# Altium project ECE8873_sample.PrjPcb
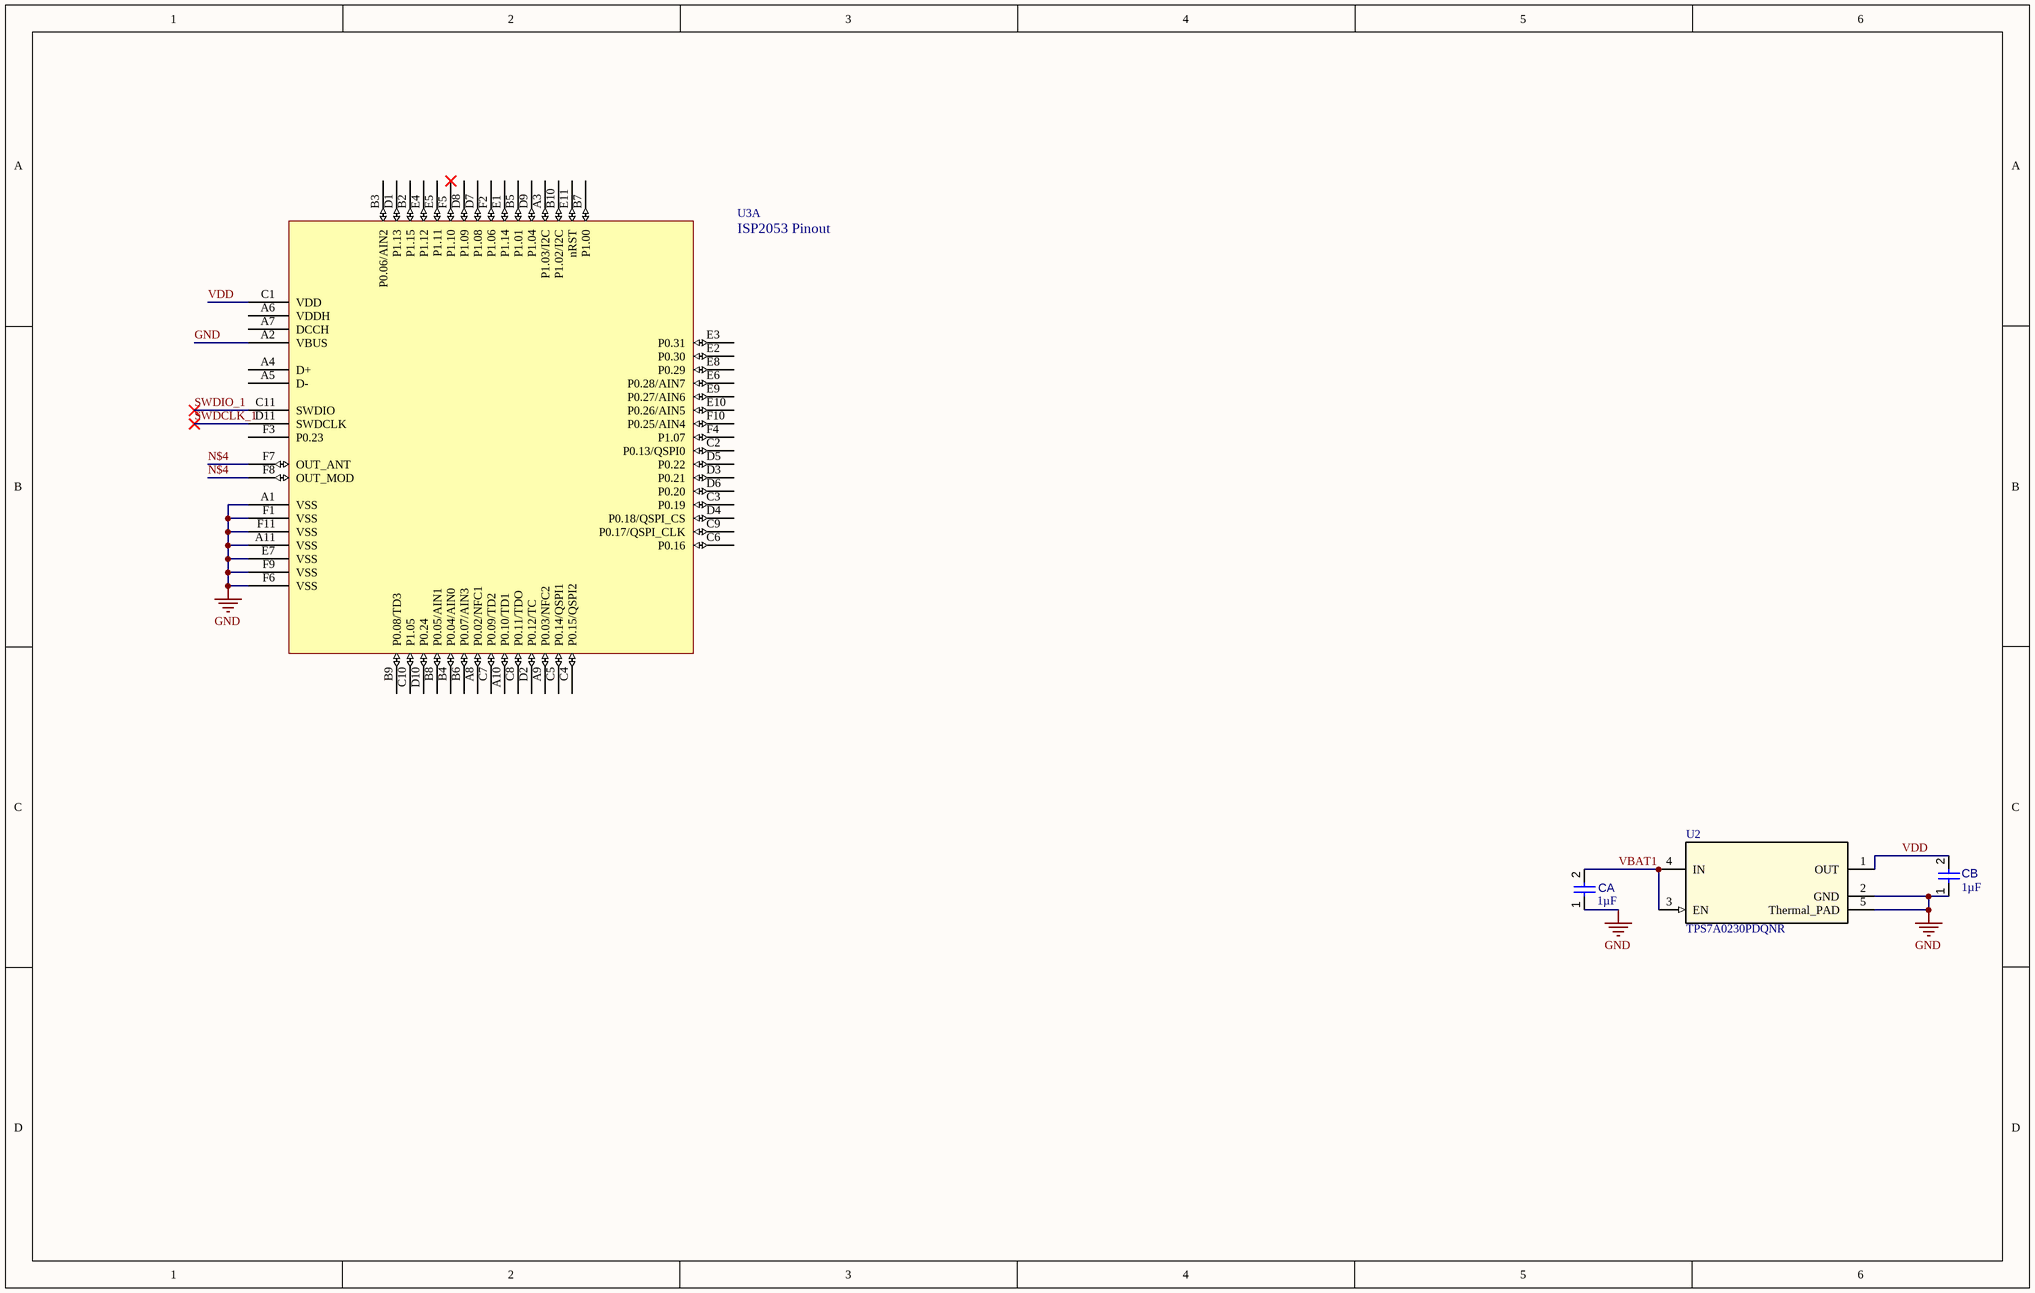
[diagram p0: ECE8873_sample.SchDoc]
1 sheet, 4 parts. Net scope: global (net labels, ports and power ports of the same name join across sheets).
Board file: ECE8873_sample.PcbDoc

## Sheet ECE8873_sample.SchDoc
size 381 x 241 mm; SheetNumber: 1; SheetTotal: 1

### Parts
CA  value 1µF  [CAPC1005X55X25LL05T10]  (hidden comment: Capacitor 1 uF +/- 10% 6.3 V 0402)
CB  value 1µF  [CAPC1005X55X25LL05T10]  (hidden comment: Capacitor 1 uF +/- 10% 6.3 V 0402)
U2  TPS7A0230PDQNR  [DQN0004A-MFG]
U3  ISP1807  [ISP2053-AX]  (value not drawn)  (part A of 2)

### Nets
GND: CA.1 CB.1 U2.2(GND) U2.5(Thermal_PAD) U3.A1(VSS) U3.A2(VBUS) U3.A11(VSS) U3.E7(VSS) U3.F1(VSS) U3.F6(VSS) U3.F9(VSS) U3.F11(VSS)
N$4: U3.F7(OUT_ANT) U3.F8(OUT_MOD)
SWDCLK_1: U3.D11(SWDCLK)
SWDIO_1: U3.C11(SWDIO)
VBAT1: CA.2 U2.3(EN) U2.4(IN)
VDD: CB.2 U2.1(OUT) U3.C1(VDD)

Not connected (* = marked no-connect by the designer): U3 A3(P1.03/I2C) A4(D+) A5(D-) A6(VDDH) A7(DCCH) A8(P0.02/NFC1) A9(P0.03/NFC2) A10(P0.10/TD1) B2(P1.15) B3(P0.06/AIN2) B4(P0.04/AIN0) B5(P1.01) B6(P0.07/AIN3) B7(P1.00) B8(P0.05/AIN1) B9(P0.08/TD3) B10(P1.02/I2C) C2(P0.13/QSPI0) C3(P0.19) C4(P0.15/QSPI2) C5(P0.14/QSPI1) C6(P0.16) C7(P0.09/TD2) C8(P0.11/TDO) C9(P0.17/QSPI_CLK) C10(P1.05) D1(P1.13) D2(P0.12/TC) D3(P0.21) D4(P0.18/QSPI_CS) D5(P0.22) D6(P0.20) D7(P1.08) D8(P1.09) D9(P1.04) D10(P0.24) E1(P1.14) E2(P0.30) E3(P0.31) E4(P1.12) E5(P1.11) E6(P0.28/AIN7) E8(P0.29) E9(P0.27/AIN6) E10(P0.26/AIN5) E11(nRST) F2(P1.06) F3(P0.23) F4(P1.07) F5(P1.10)* F10(P0.25/AIN4)

### Notes on the sheet
- (in symbol ISP2053_Pinout_New, part A) ISP2053 Pinout

### Library data of the parts
CA CB = CMP-001-00008-6: Chip Capacitor, 1 uF, +/- 10%, 6.3 V, 0402 (1005 Metric); Capacitor Type: Ceramic; Voltage Rating: 6.3V; Max Operating Temperature: 85°C; Mounting Technology: SM; Tolerance: 10%; Case/Package: 0402; RoHS Compliant: True; Min Operating Temperature: -55°C; Pins: 2
U2 = TPS7A0230PDQNR: No Description Available; Mfr_Name: Texas Instruments; TYPE: TYPE; RefDes: RefDes
U3 = ISP2053_Pinout_New: ISP Smart Bluetooth Module; BOI-Metric: QFN 8 x 8; DESIG: BLE Module; FAB: Insight SiP; BOI: QFN 8 x 8; ISP_PART: ISP1807